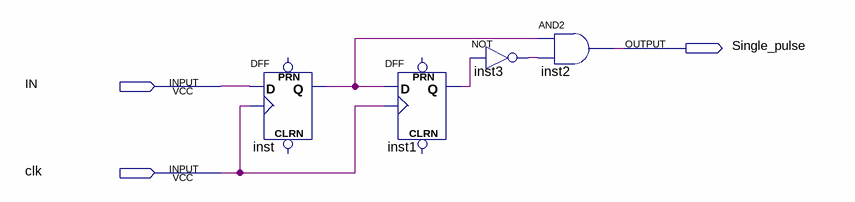
[diagram p0: schematic sheet]
// Quartus schematic debounce2.bdf as structural Verilog: 4 symbols, 3 pins
module debounce2 (
  input  IN,
  input  clk,
  output Single_pulse
);

  wire inst1_q, inst3_out, inst_q;

  DFF inst (.CLK(clk), .D(IN), .Q(inst_q));  // open: CLRN, PRN
  DFF inst1 (.CLK(clk), .D(inst_q), .Q(inst1_q));  // open: CLRN, PRN
  not inst3 (inst3_out, inst1_q);
  and inst2 (Single_pulse, inst_q, inst3_out);
endmodule
